# Altium schematic sheet WL-AUDIO.SchDoc
size 420 x 297 mm; Scale: 1:1; DocumentType: Схема электрическая принципиальная; FirstReferrence: UA3REO/R7KBI; SheetNumber: 6; SheetTotal: 12
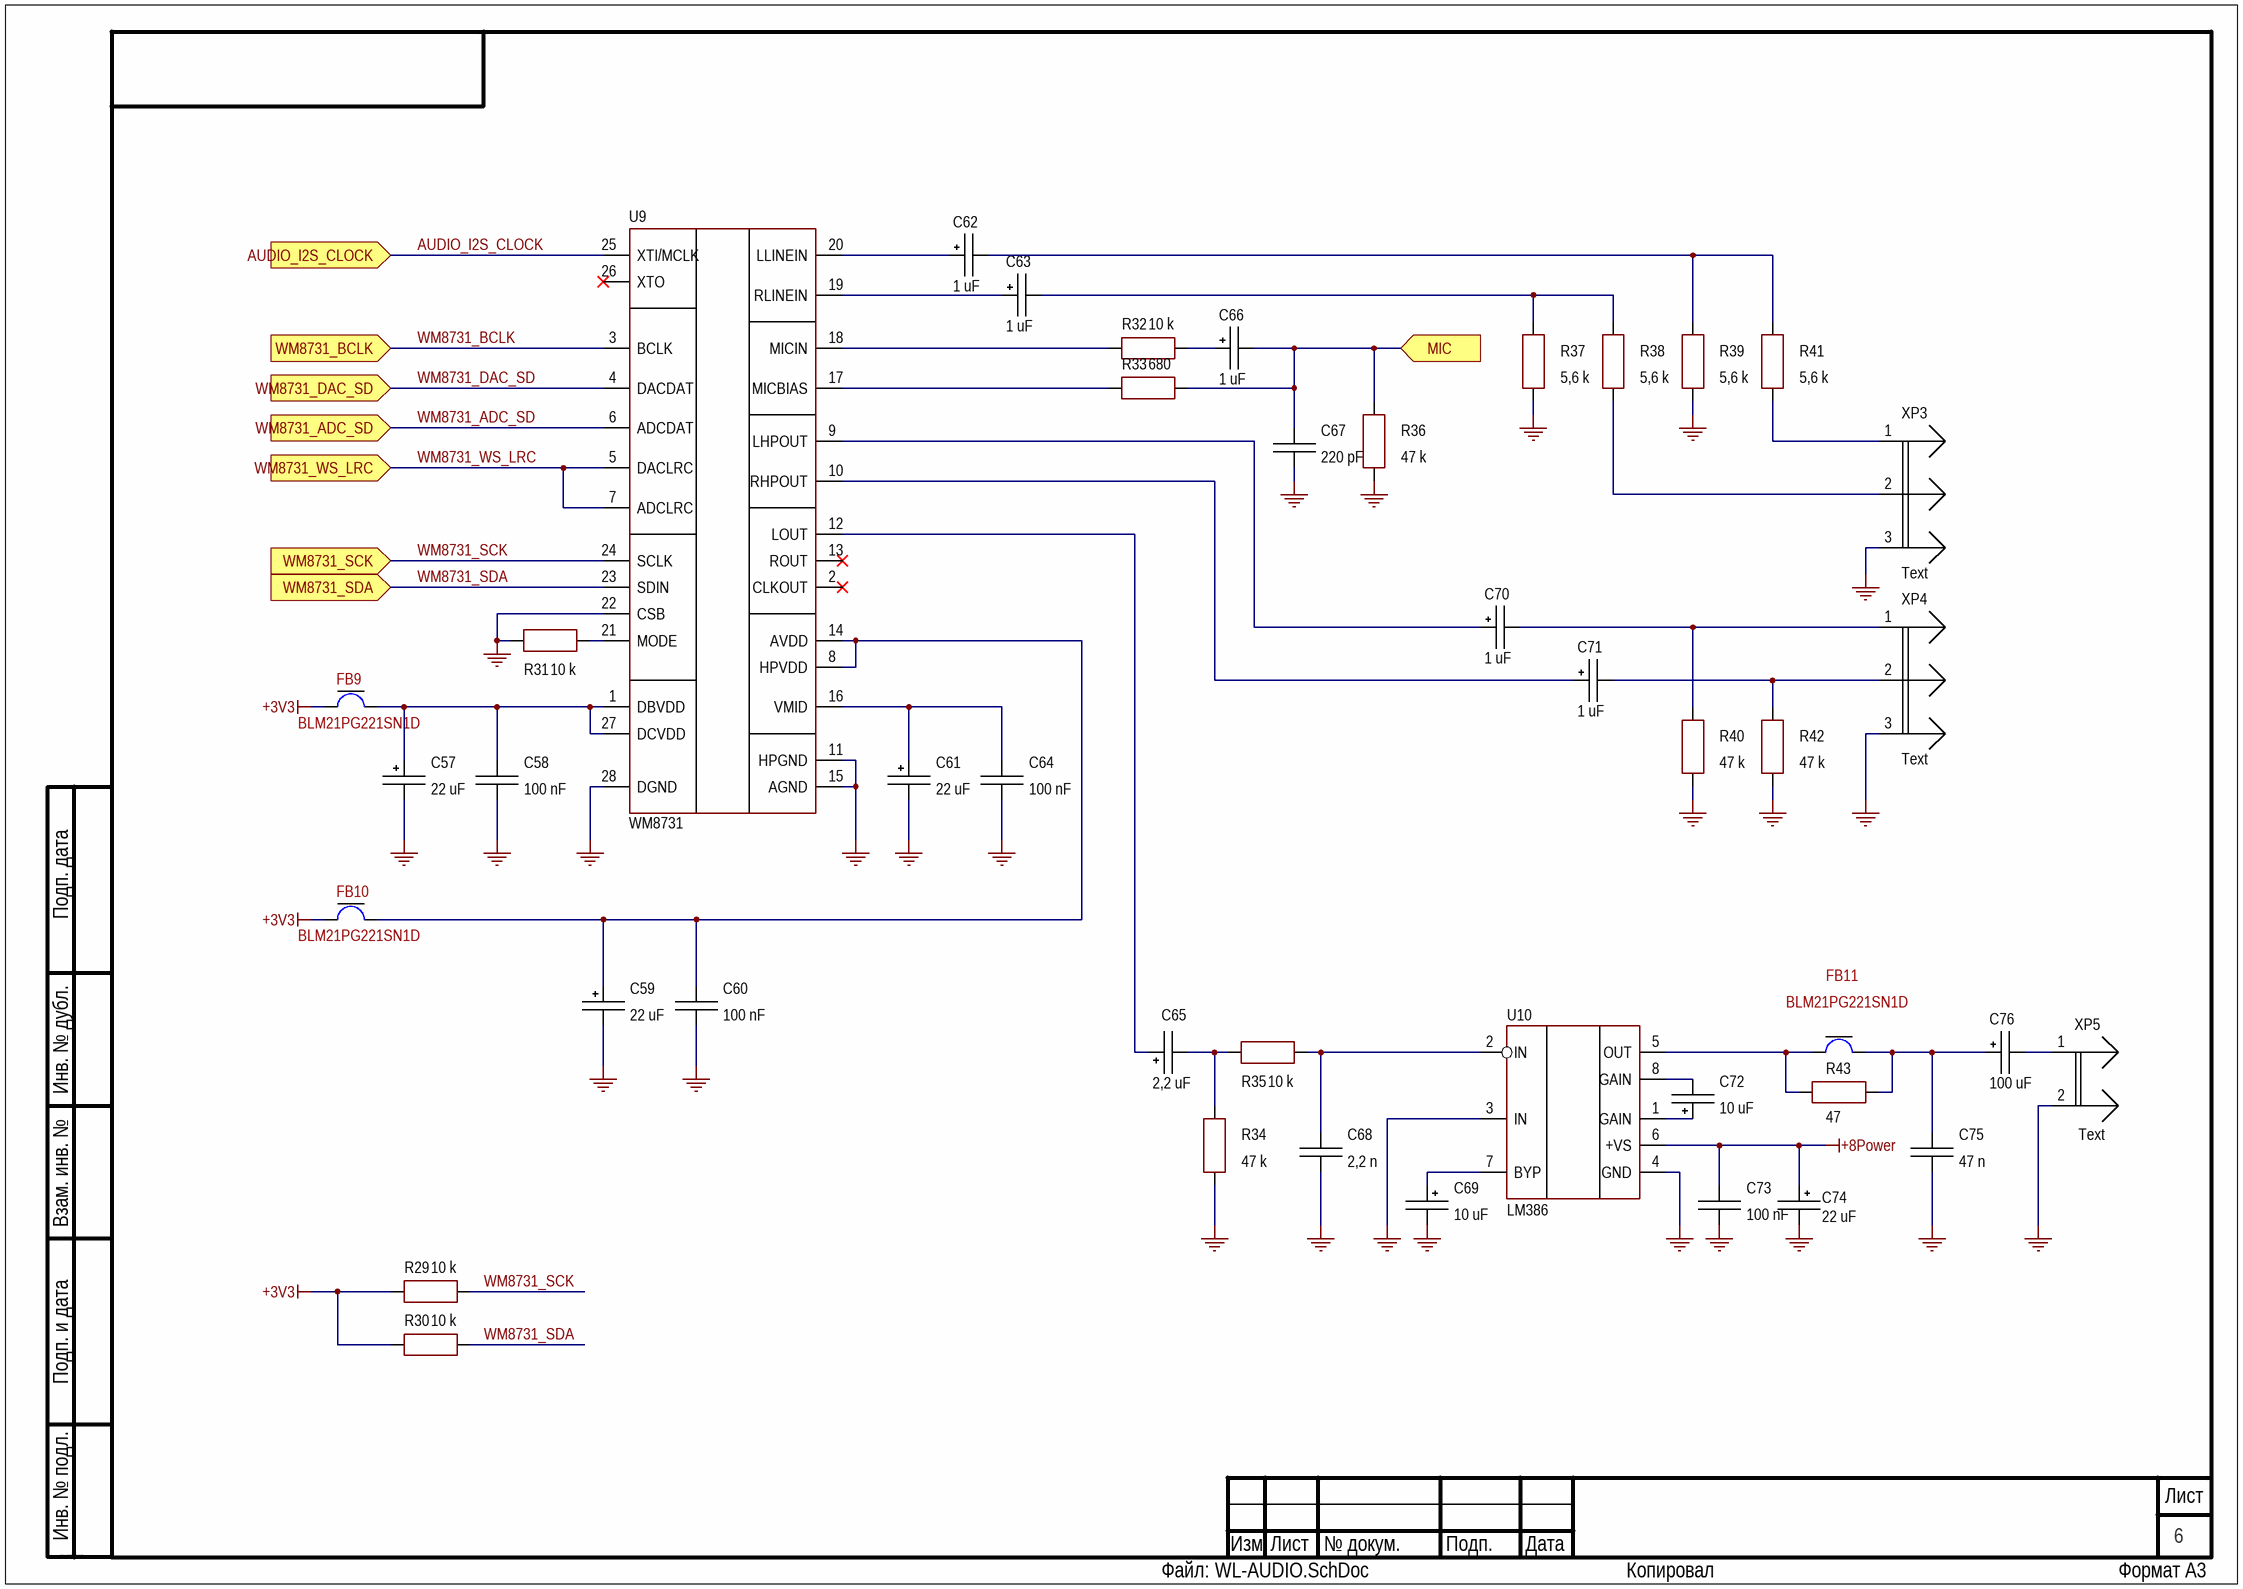
[diagram p0: WL-AUDIO.SchDoc]

## Parts
C57  22 uF  [CAP-CASE B]
C58  100 nF  [C-0805-0.95]
C59  22 uF  [CAP-CASE B]
C60  100 nF  [C-0805-0.95]
C61  22 uF  [CAP-CASE B]
C62  1 uF  [CAP-CASE B]
C63  1 uF  [CAP-CASE B]
C64  100 nF  [C-0805-0.95]
C65  2,2 uF  [CAP-CASE B]
C66  1 uF  [CAP-CASE B]
C67  220 pF  [C-0805-0.7]
C68  2,2 n  [C-0805-0.7]
C69  10 uF  [CAP-CASE B]
C70  1 uF  [CAP-CASE B]
C71  1 uF  [CAP-CASE B]
C72  10 uF  [CAP-CASE B]
C73  100 nF  [C-0805-0.95]
C74  22 uF  [CAP-CASE B]
C75  47 n  [C-0805-0.95]
C76  100 uF  [CAP-CASE E]
FB9  BLM21PG221SN1D  [L-0805]
FB10  BLM21PG221SN1D  [L-0805]
FB11  BLM21PG221SN1D  [L-0805]
R29  10 k  [R-0805]
R30  10 k  [R-0805]
R31  10 k  [R-0805]
R32  10 k  [R-0805]
R33  680  [R-0805]
R34  47 k  [R-0805]
R35  10 k  [R-0805]
R36  47 k  [R-0805]
R37  5,6 k  [R-0805]
R38  5,6 k  [R-0805]
R39  5,6 k  [R-0805]
R40  47 k  [R-0805]
R41  5,6 k  [R-0805]
R42  47 k  [R-0805]
R43  47  [R-0805]
U9  WM8731  [SSOP-28]
U10  LM386  [SOIC-8]
XP3  Text  [61900311121]
XP4  Text  [61900311121]
XP5  Text  [61900211121]

## Ports
AUDIO_I2S_CLOCK (in), MIC (in), WM8731_ADC_SD (in), WM8731_BCLK (in), WM8731_DAC_SD (in), WM8731_SCK (in), WM8731_SDA (in), WM8731_WS_LRC (in)

## Nets
+3V3: FB9.2 FB10.2 R29.1 R30.1
+8Power: C73.1 C74.1 U10.6(+VS)
GND: C57.2 C58.2 C59.2 C60.2 C61.2 C64.2 C67.2 C68.1 C69.2 C73.2 C74.2 C75.1 R31.2 R34.1 R36.1 R37.1 R39.1 R40.1 R42.1 U9.11(HPGND) U9.15(AGND) U9.22(CSB) U9.28(DGND) U10.3(IN) U10.4(GND) XP3.3 XP4.3 XP5.2
AUDIO_I2S_CLOCK: U9.25(XTI/MCLK) ; port AUDIO_I2S_CLOCK
MIC: C66.2 C67.1 R33.2 R36.2 ; port MIC
WM8731_ADC_SD: U9.6(ADCDAT) ; port WM8731_ADC_SD
WM8731_BCLK: U9.3(BCLK) ; port WM8731_BCLK
WM8731_DAC_SD: U9.4(DACDAT) ; port WM8731_DAC_SD
WM8731_SCK: R29.2 U9.24(SCLK) ; port WM8731_SCK
WM8731_SDA: R30.2 U9.23(SDIN) ; port WM8731_SDA
WM8731_WS_LRC: U9.5(DACLRC) U9.7(ADCLRC) ; port WM8731_WS_LRC
NetC57_1: C57.1 C58.1 FB9.1 U9.1(DBVDD) U9.27(DCVDD)
NetC59_1: C59.1 C60.1 FB10.1 U9.8(HPVDD) U9.14(AVDD)
NetC61_1: C61.1 C64.1 U9.16(VMID)
NetC62_1: C62.1 U9.20(LLINEIN)
NetC62_2: C62.2 R39.2 R41.1
NetC63_1: C63.1 U9.19(RLINEIN)
NetC63_2: C63.2 R37.2 R38.1
NetC65_1: C65.1 U9.12(LOUT)
NetC65_2: C65.2 R34.2 R35.2
NetC66_1: C66.1 R32.2
NetC68_2: C68.2 R35.1 U10.2(IN)
NetC69_1: C69.1 U10.7(BYP)
NetC70_1: C70.1 U9.9(LHPOUT)
NetC70_2: C70.2 R40.2 XP4.1
NetC71_1: C71.1 U9.10(RHPOUT)
NetC71_2: C71.2 R42.2 XP4.2
NetC72_1: C72.1 U10.1(GAIN)
NetC72_2: C72.2 U10.8(GAIN)
NetC75_2: C75.2 C76.1 FB11.2 R43.2
NetC76_2: C76.2 XP5.1
NetFB11_1: FB11.1 R43.1 U10.5(OUT)
NetR31_1: R31.1 U9.21(MODE)
NetR32_1: R32.1 U9.18(MICIN)
NetR33_1: R33.1 U9.17(MICBIAS)
NetR38_2: R38.2 XP3.2
NetR41_2: R41.2 XP3.1

Not connected (* = marked no-connect by the designer): U9 2(CLKOUT)* 13(ROUT)* 26(XTO)*

## Notes on the sheet
- Подп. дата
- Инв. № дубл.
- Взам. инв. №
- Подп. и дата
- Инв. № подл.
- Изм.
- Лист
- № докум.
- Подп.
- Дата
- ALTIUM GOSTBOM2.0 KEV
- Файл:
- Копировал
- Формат А3

## Library data of the parts
C57 C59 C61 = EEE-1CA220WAR: Manufacturer: Panasonic Electronic Components; Type: Конденсатор; Value: 22; Tolerance: ±20%; Voltage: 16 V; Part Number: EEE-1CA220WAR; Units: uF; Case: 4x5.4; Operating Temperature: -40 ... 85 °C; Series: S; ValueSCH: 22 uF
C58 C60 C64 C73 = CC0805KRX7R9BB104: Manufacturer: Yageo; Value: 100; Type: Конденсатор; Dielectric: X7R; Tolerance: ±10%; Voltage: 50 V; CommentDOC: ( CC - 0805 - X7R - 50 V - 100 nF ±10% ); Part Number: CC0805KRX7R9BB104; Units: nF; Case: 0805; Operating Temperature: -55 ... 125 °C; Series: CC; Value+Units: 100 nF; ValueSCH: 100 nF; ( Series - Case - Dielectric -  Voltage - Value+Units Tolerance: ( CC - 0805 - X7R - 50 V - 100 nF ±10% )
C62 C63 C66 C70 C71 = EEE-1HA010SR: Manufacturer: Panasonic Electronic Components; Type: Конденсатор; Value: 1; Tolerance: ±20%; Voltage: 50 V; CommentDOC: ( S - 50 V - 1  uF  ±20% ); Part Number: EEE-1HA010SR; Units: uF; Case: 4x5.4; Operating Temperature: -40 ... 85 °C; Series: S; ValueSCH: 1 uF; ( Series - Voltage - Value  Units  Tolerance ): ( S - 50 V - 1  uF  ±20% )
C65 = EEE-1HA2R2AR: Manufacturer: Panasonic Electronic Components; Type: Конденсатор; Value: 2,2; Tolerance: ±20%; Voltage: 50 V; Part Number: EEE-1HA2R2AR; Units: uF; Case: 4x5.5; Operating Temperature: -40 ... 85 °C; Series: S; ValueSCH: 2,2 uF
C67 = CC0805JRNPO9BN221: Manufacturer: Yageo; Value: 220; Type: Конденсатор; Dielectric: NPO; Tolerance: ±5%; Voltage: 50 V; CommentDOC: ( CC - 0805 - NPO - 50 V - 220 pF ±5% ); Part Number: CC0805JRNPO9BN221; Units: pF; Case: 0805; Operating Temperature: -55 ... 125 °C; Series: CC; Value+Units: 220 pF; ValueSCH: 220 pF; ( Series - Case - Dielectric -  Voltage - Value+Units Tolerance: ( CC - 0805 - NPO - 50 V - 220 pF ±5% )
C68 = CC0805KRX7R9BB222: Manufacturer: Yageo; Type: Конденсатор; Dielectric: X7R; Value: 2,2; Units: nF; Tolerance: ±10%; Voltage: 50 V; Value+Units: 2,2 nF; CommentDOC: ( CC - 0805 - X7R - 50 V - 2,2 nF ±10% ); Part Number: CC0805KRX7R9BB222; Case: 0805; Operating Temperature: -55 ... 125 °C; Series: CC; ValueSCH: 2,2 n; ( Series - Case - Dielectric -  Voltage - Value+Units Tolerance: ( CC - 0805 - X7R - 50 V - 2,2 nF ±10% )
C69 C72 = EEE-1EA100WR: Manufacturer: Panasonic Electronic Components; Type: Конденсатор; Value: 10; Tolerance: ±20%; Voltage: 25 V; CommentDOC: ( S - 25 V - 10  uF  ±20% ); Part Number: EEE-1EA100WR; Units: uF; Case: 4x5.4; Operating Temperature: -40 ... 85 °C; Series: S; ValueSCH: 10 uF; ( Series - Voltage - Value  Units  Tolerance ): ( S - 25 V - 10  uF  ±20% )
C74 = EEE-1CA220WAR: Manufacturer: Panasonic Electronic Components; Type: Конденсатор; Value: 22; Tolerance: ±20%; Voltage: 16 V; CommentDOC: ( S - 16 V - 22  uF  ±20% ); Part Number: EEE-1CA220WAR; Units: uF; Case: 4x5.4; Operating Temperature: -40 ... 85 °C; Series: S; ValueSCH: 22 uF; ( Series - Voltage - Value  Units  Tolerance ): ( S - 16 V - 22  uF  ±20% )
C75 = CC0805KRX7R9BB473: Manufacturer: Yageo; Type: Конденсатор; Dielectric: X7R; Value: 47; Units: nF; Tolerance: ±10%; Voltage: 50 V; Value+Units: 47 nF; CommentDOC: ( CC - 0805 - X7R - 50 V - 47 nF ±10% ); Part Number: CC0805KRX7R9BB473; Case: 0805; Operating Temperature: -55 ... 125 °C; Series: CC; ValueSCH: 47 n; ( Series - Case - Dielectric -  Voltage - Value+Units Tolerance: ( CC - 0805 - X7R - 50 V - 47 nF ±10% )
C76 = EEE-1CA101P: Manufacturer: Panasonic Electronic Components; Type: Конденсатор; Value: 100; Tolerance: ±20%; Voltage: 16 V; CommentDOC: ( S - 16 V - 100  uF  ±20% ); Part Number: EEE-1CA101P; Units: uF; Case: 8x6.2; Operating Temperature: -40 ... 85 °C; Series: S; ValueSCH: 100 uF; ( Series - Voltage - Value  Units  Tolerance ): ( S - 16 V - 100  uF  ±20% )
FB9-FB11 = BLM21PG221SN1D: Manufacturer: Murata Electronics; Type: Ферритовая бусина; Part Number: BLM21PG221SN1D; Series: EMIFIL; Case: 0805; ValueSCH: BLM21PG221SN1D; Operating Temperature: −55°C ... 125°C
R29-R32 R35 = RC0805JR-0710KL: Manufacturer: Yageo; Value: 10; Power: 0,125 W; Units: kOhm; Tolerance: ±5%; Operating Voltage: 150 V; Value+Units: 10 kOhm; CommentDOC: ( RC - 0805 - 0,125 W - 10 kOhm  ±5% ); Type: Резистор; Part Number: RC0805JR-0710KL; Case: 0805; Operating Temperature: -55°C ... 155°C; ValueSCH: 10 k; Series: RC
R33 = RC0805JR-07680RL: Manufacturer: Yageo; Power: 0,125 W; Units: Ohm; Tolerance: ±5%; Operating Voltage: 150 V; Value+Units: 680 Ohm; CommentDOC: ( RC - 0805 - 0,125 W - 680 Ohm  ±5% ); Value: 680; Type: Резистор; Part Number: RC0805JR-07680RL; Case: 0805; Operating Temperature: -55°C ... 155°C; ValueSCH: 680; Series: RC
R34 = RC0805JR-0747KL: Manufacturer: Yageo; Power: 0,125 W; Value: 47; Units: kOhm; Tolerance: ±5%; Operating Voltage: 150 V; Value+Units: 47 kOhm; CommentDOC: ( RC - 0805 - 0,125 W - 47 kOhm  ±5% ); Type: Резистор; Part Number: RC0805JR-0747KL; Case: 0805; Operating Temperature: -55°C ... 155°C; ValueSCH: 47 k; Series: RC
R36 R40 R42 = RC0805JR-0747KL: Manufacturer: Yageo; Value: 47; Power: 0,125 W; Units: kOhm; Tolerance: ±5%; Operating Voltage: 150 V; Value+Units: 47 kOhm; CommentDOC: ( RC - 0805 - 0,125 W - 47 kOhm  ±5% ); Type: Резистор; Part Number: RC0805JR-0747KL; Case: 0805; Operating Temperature: -55°C ... 155°C; ValueSCH: 47 k; Series: RC
R37-R39 R41 = RC0805JR-075K6L: Manufacturer: Yageo; Value: 5,6; Power: 0,125 W; Units: kOhm; Tolerance: ±5%; Operating Voltage: 150 V; Value+Units: 5,6 kOhm; CommentDOC: ( RC - 0805 - 0,125 W - 5,6 kOhm  ±5% ); Type: Резистор; Part Number: RC0805JR-075K6L; Case: 0805; Operating Temperature: -55°C ... 155°C; ValueSCH: 5,6 k; Series: RC
R43 = RC0805JR-0747RL: Manufacturer: Yageo; Power: 0,125 W; Units: Ohm; Tolerance: ±5%; Operating Voltage: 150 V; Value+Units: 47 Ohm; CommentDOC: ( RC - 0805 - 0,125 W - 47 Ohm  ±5% ); Type: Резистор; Part Number: RC0805JR-0747RL; Value: 47; Case: 0805; Operating Temperature: -55°C ... 155°C; ValueSCH: 47; Series: RC
U9 = WM8731SEDS/RV: IC CODEC; Manufacturer: Cirrus Logic Inc.; Voltage  Supply: +2,7 V … 3,6 V / +1,42 V … 3,6 V; Part Number: WM8731SEDS/RV; ValueSCH: WM8731; Function: IC CODEC; Case: SSOP-28; Operating Temperature: -40°С ... 85°С; Type: Микросхема
U10 = LM386M-1/NOPB: IC AMP CLASS AB MONO; Manufacturer: Texas Instruments; Function: IC AMP CLASS AB MONO 325 mW; Voltage  Supply: 4 … 12 V; Type: Микросхема; Part Number: LM386M-1/NOPB; Case: SOIC-8; Operating Temperature: 0 ... 70 °C
XP3 XP4 = 61900311121: Manufacturer: Würth Elektronik; Pitch: 2,54 mm; Functional Analog: WF-3; Type: Вилка; Part Number: 61900311121; Series: WE-WTB; Number of Pins: 3; Operating Temperature: −40°C ... 105°C
XP5 = 61900211121: Manufacturer: Würth Elektronik; Pitch: 2,54 mm; Functional Analog: WF-2; Type: Вилка; Part Number: 61900211121; Series: WE-WTB; Number of Pins: 2; Operating Temperature: −40°C ... 105°C